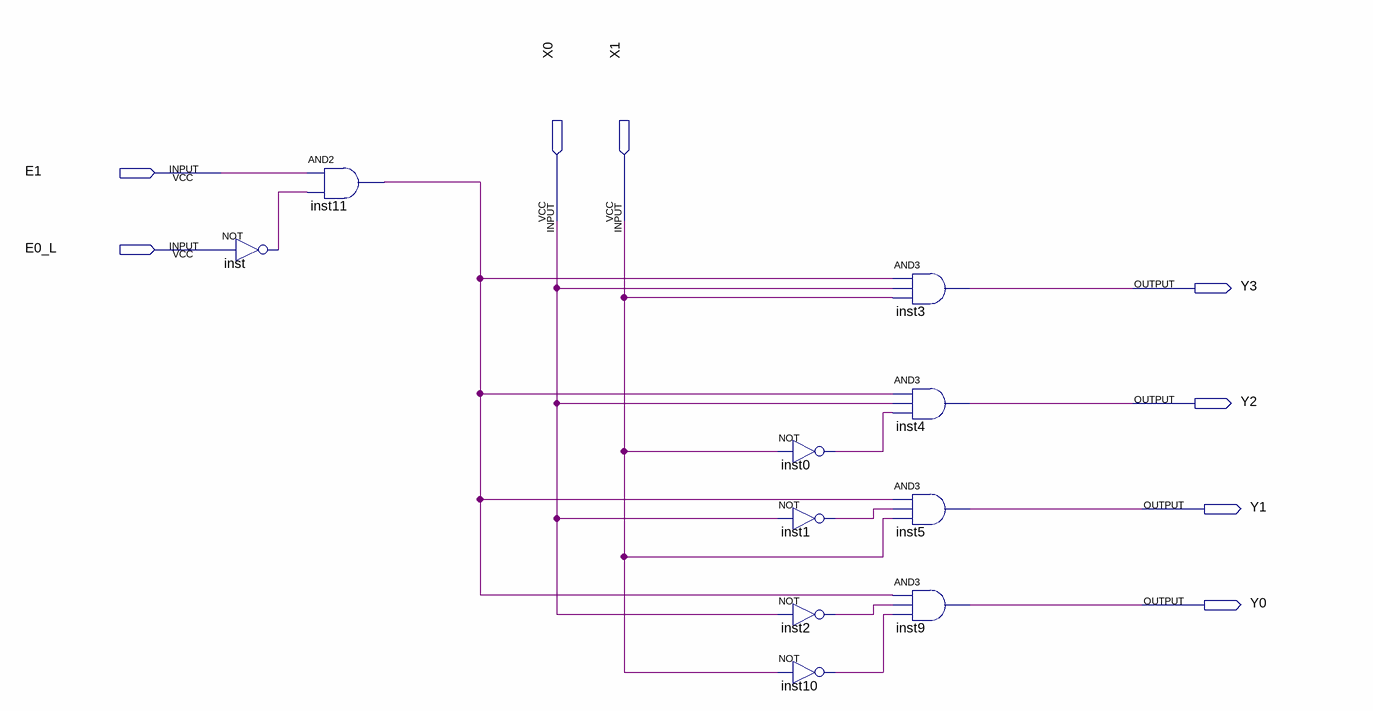
[diagram p0: schematic sheet]
// Quartus schematic Dec2_4.bdf as structural Verilog: 10 symbols, 8 pins
module Dec2_4 (
  input  E1,
  input  X0,
  input  X1,
  input  E0_L,
  output Y3,
  output Y2,
  output Y1,
  output Y0
);

  wire inst0_out, inst1_out, inst2_out, inst10_out, inst11_out, inst_out;

  not inst (inst_out, E0_L);
  and inst11 (inst11_out, E1, inst_out);
  not inst0 (inst0_out, X1);
  not inst1 (inst1_out, X0);
  not inst2 (inst2_out, X0);
  not inst10 (inst10_out, X1);
  and inst3 (Y3, inst11_out, X0, X1);
  and inst4 (Y2, inst11_out, X0, inst0_out);
  and inst5 (Y1, inst11_out, inst1_out, X1);
  and inst9 (Y0, inst11_out, inst2_out, inst10_out);
endmodule
